# EAGLE design zxld400-9-leds-mk-2-leds (EAGLE 6.5.0)
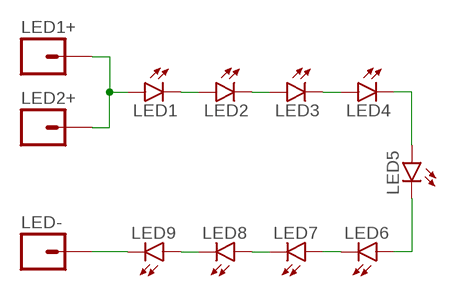
[diagram p0: schematic, sheet 1]

## Parts
LED1  LED5MM_SHORTPADS  [LED5MM_SHORTPADS]
LED1+  M01PTH  [1X01]
LED2  LED5MM_SHORTPADS  [LED5MM_SHORTPADS]
LED2+  M01PTH  [1X01]
LED3  LED5MM_SHORTPADS  [LED5MM_SHORTPADS]
LED4  LED5MM_SHORTPADS  [LED5MM_SHORTPADS]
LED5  LED5MM_SHORTPADS  [LED5MM_SHORTPADS]
LED6  LED5MM_SHORTPADS  [LED5MM_SHORTPADS]
LED7  LED5MM_SHORTPADS  [LED5MM_SHORTPADS]
LED8  LED5MM_SHORTPADS  [LED5MM_SHORTPADS]
LED9  LED5MM_SHORTPADS  [LED5MM_SHORTPADS]
LED-  M01PTH  [1X01]

## Nets
N$1: LED1+.1 LED1.A LED2+.1
N$2: LED9.K(C) LED-.1
N$5: LED1.K(C) LED2.A
N$6: LED2.K(C) LED3.A
N$7: LED3.K(C) LED4.A
N$8: LED4.K(C) LED5.A
N$9: LED5.K(C) LED6.A
N$10: LED6.K(C) LED7.A
N$11: LED7.K(C) LED8.A
N$12: LED8.K(C) LED9.A

## Library data of the parts
LED1-LED9 = A_butts:LED: LEDs Standard schematic elements and footprints for 5mm, 3mm, 1206, and 0603 sized LEDs. 5mm - Spark Fun Electronics SKU : COM-00529 (and others)
LED1+ LED2+ LED- = A_butts:M01: Header 1 Standard 1-pin 0.1" header. Use with straight break away headers (SKU : PRT-00116), right angle break away headers (PRT-00553), swiss pins (PRT-00743), machine pins (PRT-00117), and female headers (PRT-00115).

## Board
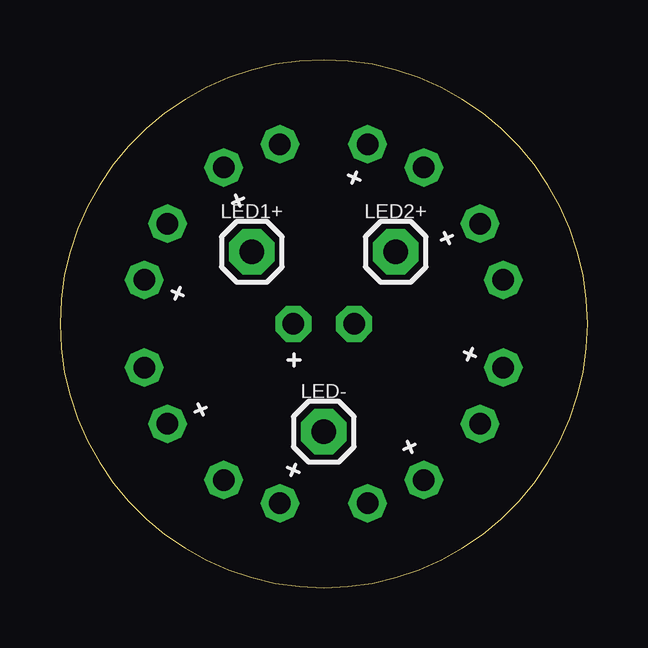
[diagram p1: board, top side]
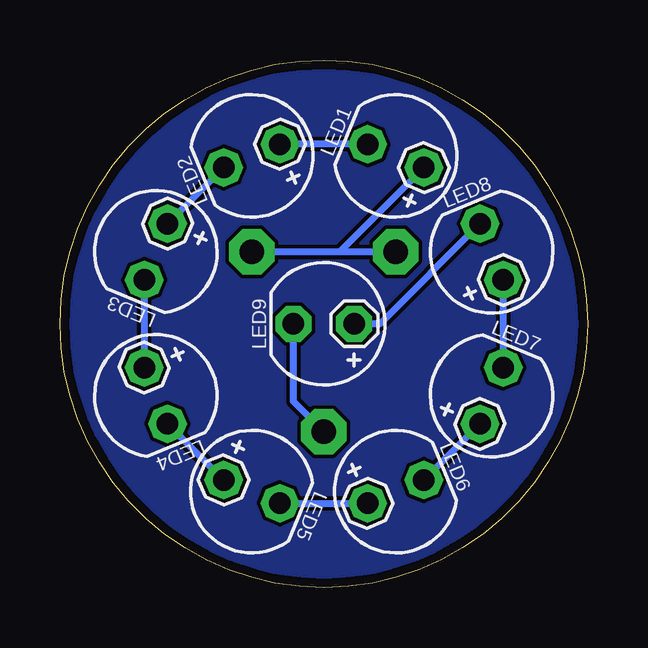
[diagram p2: board, bottom side, seen from below]

Size 22 x 22 mm. Coordinates in mm from the lower left corner, seen from the top.
Outline: 0,11 arc90 11,0 arc90 22,11 arc90 11,22 arc90 0,11
Copper layers (1*16): Top 0.0356mm / dielectric 1.5011mm / Bottom 0.0356mm
Design rules "LaenPCBOrder2": minimum track width 6mil, minimum drill 13mil, track to track 6mil, track to pad 6mil, pad to pad 6mil, via to via 6mil, smd to smd 6mil, copper to edge 15mil, drill to drill 6mil, minimum pad ring 7mil, minimum via ring 7mil, stop-mask expansion 3mil, vias tented up to drill 20mil, thermal gap 10mil

### Footprints (pad centres in the part's own frame; a part is rotated, then mirrored left to right if it is on the bottom)
LED5MM_SHORTPADS = drill 0.9 pad 1.5 octagon: A -1.27,0; K 1.27,0
1X01 = drill 1.016 pad 1.88 octagon: 1 0,0

### Placement (x,y rotation side)
LED1  8,18 157.5 bottom
LED1+  8,14 0 top
LED2  14,18 202.5 bottom
LED2+  14,14 0 top
LED3  18,14 247.5 bottom
LED4  18,8 292.5 bottom
LED5  14,4 337.5 bottom
LED6  8,4 22.5 bottom
LED7  4,8 67.5 bottom
LED8  4,14 112.5 bottom
LED9  11,11 180 bottom
LED-  11,6.5 0 top

### Tracks (layer width: path | path; a pad name or v marks a point on that pad's centre or on a via)
GND
  pour Bottom: 11,0 arc-90 0,11 arc-90 11,22 arc-90 22,11 arc-90
N$1
  Bottom 0.3: LED1.A 10.34,14 | 10.34,14 10.5,14 LED2+.1 | LED1+.1 10.34,14
N$2
  Bottom 0.3: LED-.1 12.27,7.77 LED9.K
N$5
  Bottom 0.3: LED1.K LED2.A
N$6
  Bottom 0.3: LED2.K LED3.A
N$7
  Bottom 0.3: LED3.K LED4.A
N$8
  Bottom 0.3: LED4.K LED5.A
N$9
  Bottom 0.3: LED5.K LED6.A
N$10
  Bottom 0.3: LED6.K LED7.A
N$11
  Bottom 0.3: LED7.K LED8.A
N$12
  Bottom 0.3: LED8.K 8.66,11 LED9.A